# EAGLE schematic Steering Wheel Board (EAGLE 8.4.1)
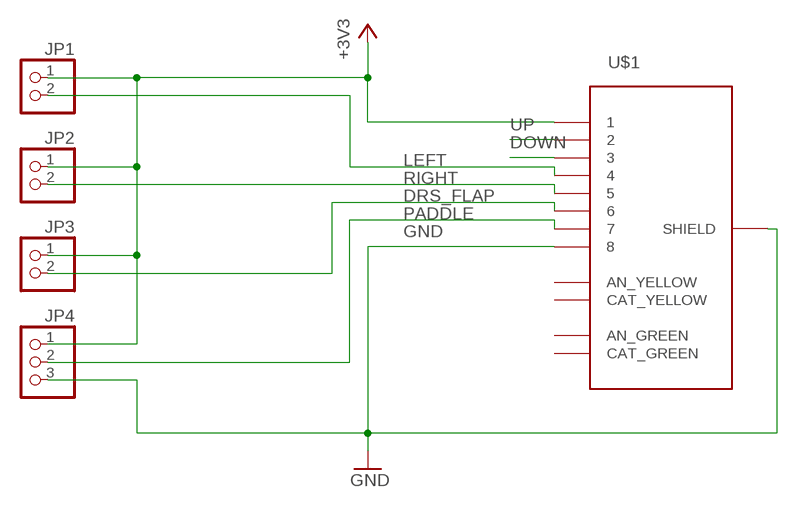
[diagram p0: schematic, sheet 1]

## Parts
JP1  PINHD-1X2  [1X02]
JP2  PINHD-1X2  [1X02]
JP3  PINHD-1X2  [1X02]
JP4  PINHD-1X3  [1X03]
U$1  RJ-45_12-PIN  [RJ-45]

## Nets
+3V3: JP1.1 JP2.1 JP3.1 JP4.1 U$1.P$1
DOWN: U$1.P$3
DRS_FLAP: JP3.2 U$1.P$6
GND: JP4.3 U$1.P$8 U$1.P$13(SHIELD)
LEFT: JP1.2 U$1.P$4
PADDLE: JP4.2 U$1.P$7
RIGHT: JP2.2 U$1.P$5
UP: U$1.P$2
Unconnected: U$1.P$9(AN_YELLOW) U$1.P$10(CAT_YELLOW) U$1.P$11(AN_GREEN) U$1.P$12(CAT_GREEN)

## Library data of the parts
JP1-JP3 = pinhead:PINHD-1X2: PIN HEADER
JP4 = pinhead:PINHD-1X3: PIN HEADER
U$1 = FormE:RJ-45_12-PIN